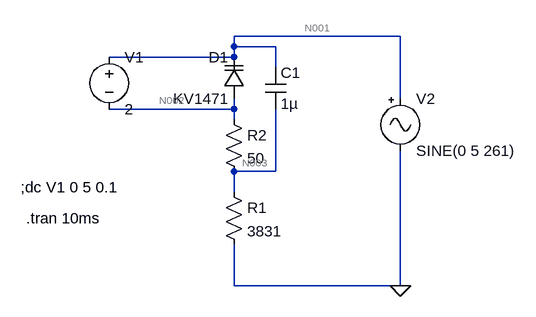
[diagram p0: schematic Varactor_test.asc]
Varactor_test.asc, the LTspice schematic file:
Version 4
SHEET 1 928 680
WIRE 304 32 48 32
WIRE 48 48 48 32
WIRE 112 48 48 48
WIRE 48 64 48 48
WIRE 48 64 -144 64
WIRE 112 80 112 48
WIRE 304 128 304 32
WIRE 48 144 48 128
WIRE 48 144 -144 144
WIRE 48 160 48 144
WIRE 112 240 112 144
WIRE 112 240 48 240
WIRE 48 272 48 240
WIRE 48 416 48 352
WIRE 304 416 304 208
WIRE 304 416 48 416
FLAG 304 416 0
SYMBOL varactor 64 128 R180
WINDOW 0 24 64 Left 2
WINDOW 3 24 0 Left 2
SYMATTR InstName D1
SYMATTR Value KV1471
SYMBOL voltage -144 48 R0
WINDOW 123 0 0 Left 0
WINDOW 39 0 0 Left 0
SYMATTR InstName V1
SYMATTR Value 2
SYMBOL res 32 256 R0
SYMATTR InstName R1
SYMATTR Value 3831
SYMBOL Misc\\signal 304 112 R0
WINDOW 123 0 0 Left 0
WINDOW 39 0 0 Left 0
SYMATTR InstName V2
SYMATTR Value SINE(0 5 261)
SYMBOL cap 96 80 R0
SYMATTR InstName C1
SYMATTR Value 1µ
SYMBOL res 32 144 R0
SYMATTR InstName R2
SYMATTR Value 50
TEXT -280 264 Left 2 !;dc V1 0 5 0.1
TEXT -272 312 Left 2 !.tran 10ms

The netlist it stands for:
* Varactor_test.asc
D1 N002 N001 KV1471
V1 N001 N002 2
R1 N003 0 3831
V2 N001 0 SINE(0 5 261)
C1 N001 N003 1µ
R2 N002 N003 50
.model D D
.lib standard.dio
;dc V1 0 5 0.1
.tran 10ms
.backanno
.end

* Results of the author's LTspice run, read from the files saved beside the schematic
* Operating Point, zero values left out:
*   V(n002) = -2 V
*   V(n003) = -1.974 V
*   I(D1) = -2.8 pA
*   I(R2) = -515.3 µA
*   I(R1) = -515.3 µA
*   I(V2) = 515.3 µA
*   I(V1) = -515.3 µA
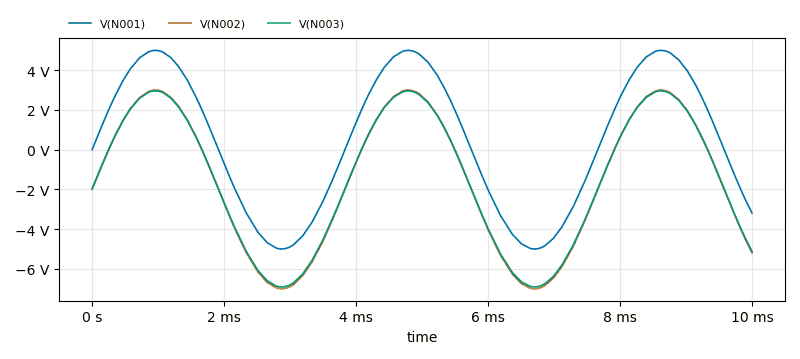
[diagram p1: Transient Analysis of Varactor_test.asc, plotted from the saved traces]
* Transient Analysis, 1 run:
*   V(N001): min -5 V, max 4.998 V, average 540.1 mV, rms 3.48 V, last -3.187 V
*   V(N002): min -7 V, max 2.998 V, average -1.46 V, rms 3.735 V, last -5.187 V
*   V(N003): min -6.91 V, max 2.96 V, average -1.441 V, rms 3.687 V, last -5.125 V